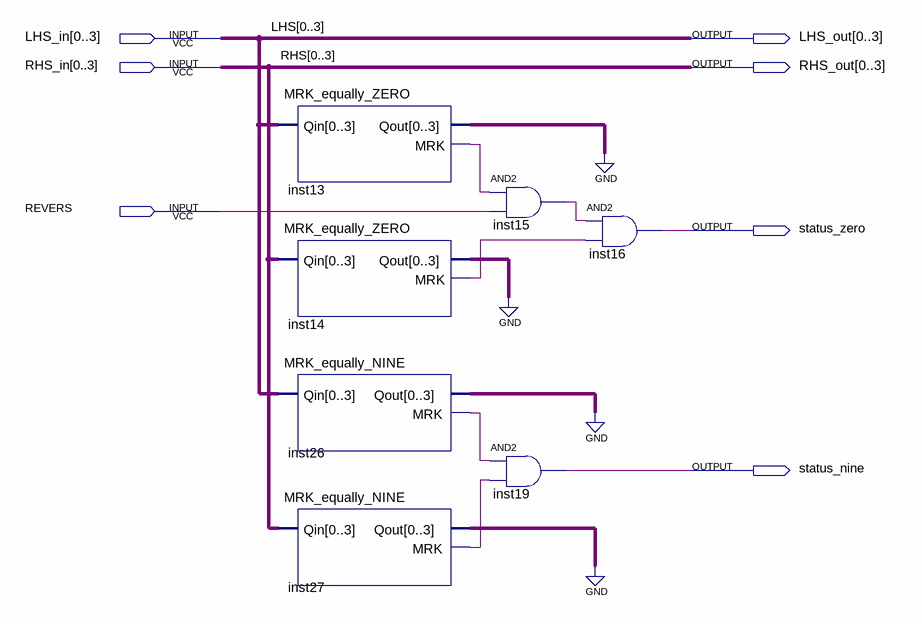
[diagram p0: schematic sheet]
// Quartus schematic num_status.bdf as structural Verilog: 7 symbols, 7 pins
module num_status (
  input  [0:3] LHS_in,
  input  [0:3] RHS_in,
  input  REVERS,
  output [0:3] LHS_out,
  output [0:3] RHS_out,
  output status_zero,
  output status_nine
);

  wire inst13_mrk, inst14_mrk, inst15_out, inst26_mrk, inst27_mrk;
  wire [3:0] inst13_qout, inst14_qout, inst26_qout, inst27_qout;

  MRK_equally_ZERO inst13 (.Qin(LHS_in), .Qout(inst13_qout), .MRK(inst13_mrk));
  MRK_equally_ZERO inst14 (.Qin(RHS_in), .Qout(inst14_qout), .MRK(inst14_mrk));
  MRK_equally_NINE inst26 (.Qin(LHS_in), .Qout(inst26_qout), .MRK(inst26_mrk));
  MRK_equally_NINE inst27 (.Qin(RHS_in), .Qout(inst27_qout), .MRK(inst27_mrk));
  and inst15 (inst15_out, inst13_mrk, REVERS);
  and inst19 (status_nine, inst26_mrk, inst27_mrk);
  and inst16 (status_zero, inst15_out, inst14_mrk);

  assign LHS_out = LHS_in;
  assign RHS_out = RHS_in;
  // also tied to GND on the sheet: {inst13_qout[0], inst13_qout[1], inst13_qout[2], inst13_qout[3], inst14_qout[0], inst14_qout[1], inst14_qout[2], inst14_qout[3], inst26_qout[0], inst26_qout[1], inst26_qout[2], inst26_qout[3], inst27_qout[0], inst27_qout[1], inst27_qout[2], inst27_qout[3]}

  // Other names for the same wires on the sheet: LHS[3:0] = {LHS_in[3], LHS_in[2], LHS_in[1], LHS_in[0]};
  //   RHS[3:0] = {RHS_in[3], RHS_in[2], RHS_in[1], RHS_in[0]}
endmodule
